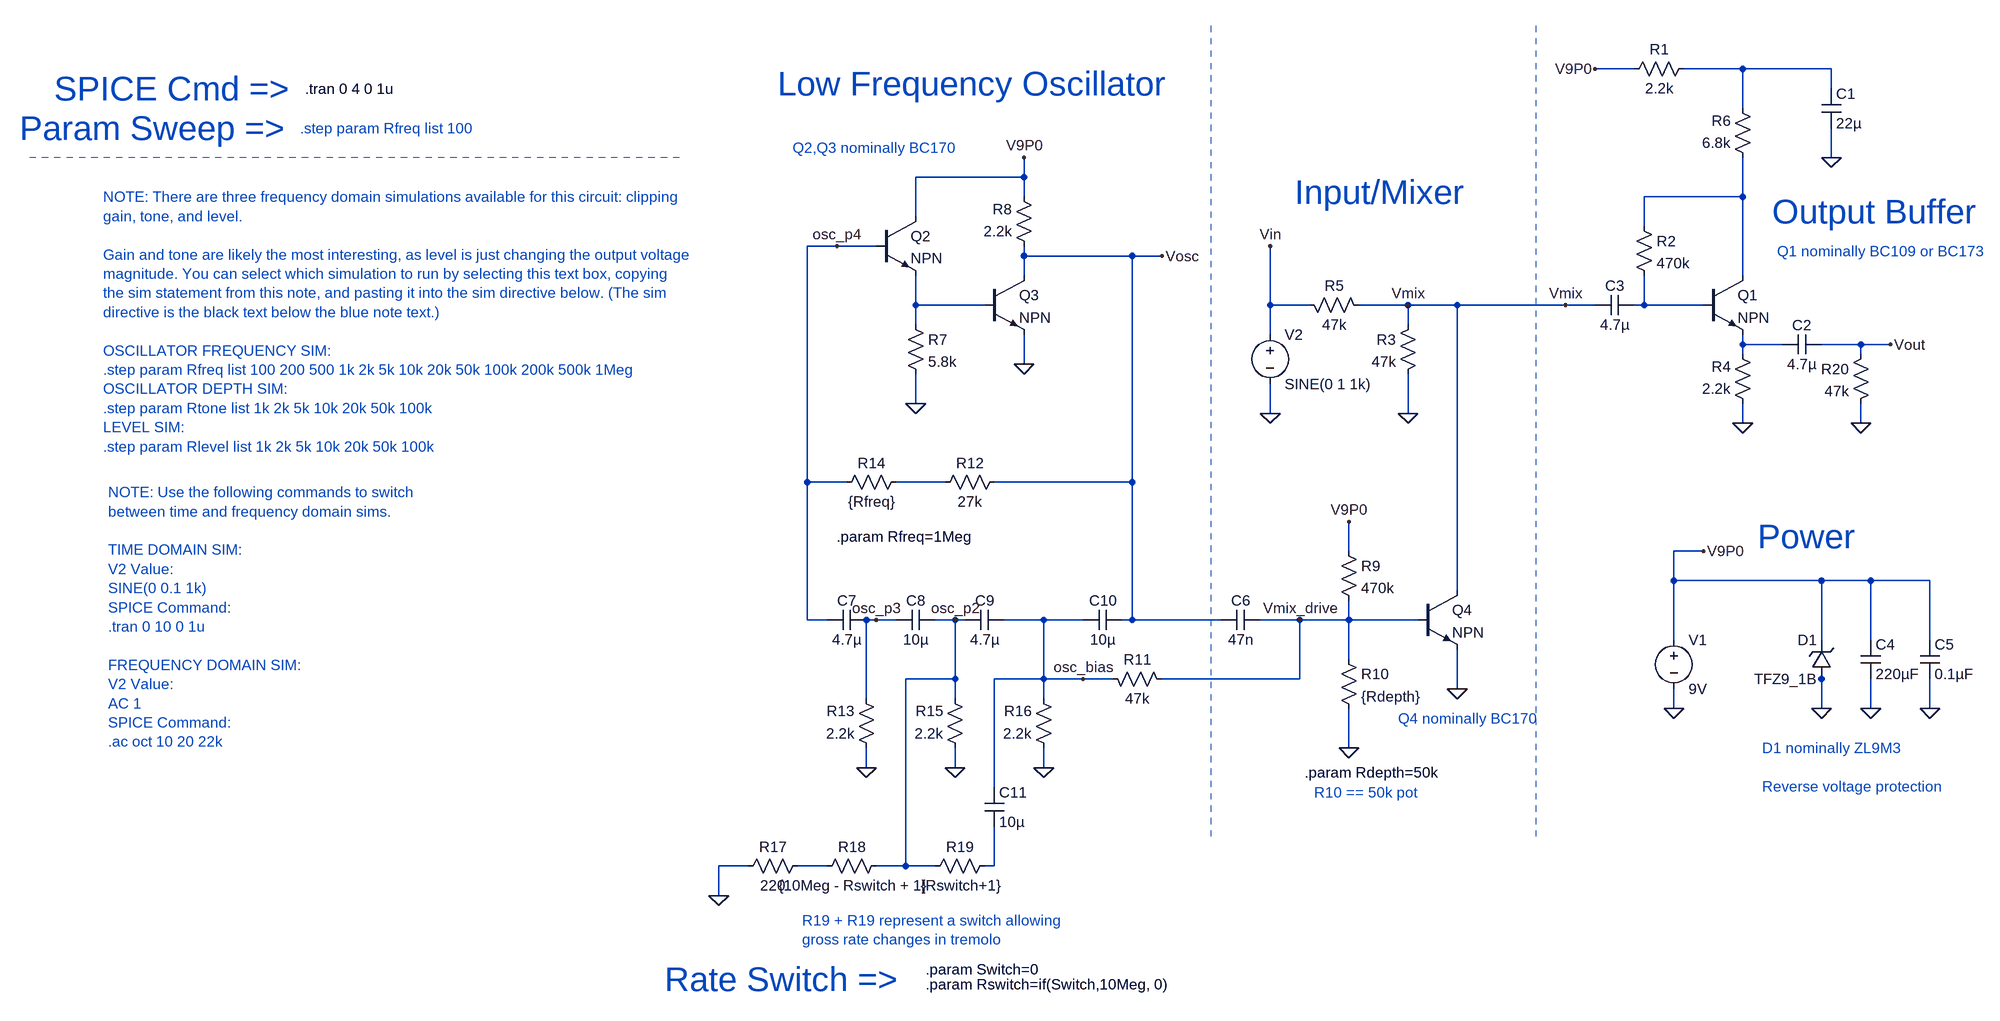
[diagram p0: schematic schaller-tremolo.asc]
schaller-tremolo.asc, the LTspice schematic file:
Version 4
SHEET 1 2340 1524
WIRE 1248 -368 1184 -368
WIRE 1424 -368 1328 -368
WIRE 1568 -368 1424 -368
WIRE 1568 -336 1568 -368
WIRE 1424 -304 1424 -368
WIRE 1568 -224 1568 -272
WIRE 256 -192 256 -224
WIRE 256 -192 80 -192
WIRE 256 -160 256 -192
WIRE 1424 -160 1424 -224
WIRE 1424 -160 1264 -160
WIRE 80 -128 80 -192
WIRE 1264 -112 1264 -160
WIRE -48 -80 -96 -80
WIRE 16 -80 -48 -80
WIRE 256 -64 256 -80
WIRE 432 -64 256 -64
WIRE 480 -64 432 -64
WIRE 256 -32 256 -64
WIRE 1424 -32 1424 -160
WIRE 80 16 80 -32
WIRE 192 16 80 16
WIRE 656 16 656 -80
WIRE 720 16 656 16
WIRE 880 16 800 16
WIRE 960 16 880 16
WIRE 1136 16 960 16
WIRE 1184 16 1136 16
WIRE 1264 16 1264 -32
WIRE 1264 16 1248 16
WIRE 1360 16 1264 16
WIRE 80 48 80 16
WIRE 880 48 880 16
WIRE 656 64 656 16
WIRE 1424 80 1424 64
WIRE 1488 80 1424 80
WIRE 1616 80 1552 80
WIRE 1664 80 1616 80
WIRE 1424 96 1424 80
WIRE 1616 96 1616 80
WIRE 256 112 256 64
WIRE 80 176 80 128
WIRE 656 192 656 144
WIRE 880 192 880 128
WIRE 1424 208 1424 176
WIRE 1616 208 1616 176
WIRE -96 304 -96 -80
WIRE -32 304 -96 304
WIRE 128 304 48 304
WIRE 432 304 432 -64
WIRE 432 304 208 304
WIRE 784 416 784 368
WIRE 1360 416 1312 416
WIRE 1312 464 1312 416
WIRE 1552 464 1312 464
WIRE 1632 464 1552 464
WIRE 1728 464 1632 464
WIRE 960 480 960 16
WIRE -96 528 -96 304
WIRE -64 528 -96 528
WIRE 0 528 -16 528
WIRE 16 528 0 528
WIRE 48 528 16 528
WIRE 144 528 112 528
WIRE 160 528 144 528
WIRE 288 528 224 528
WIRE 352 528 288 528
WIRE 432 528 432 304
WIRE 432 528 416 528
WIRE 576 528 432 528
WIRE 704 528 640 528
WIRE 784 528 784 496
WIRE 784 528 704 528
WIRE 896 528 784 528
WIRE 1312 560 1312 464
WIRE 1552 560 1552 464
WIRE 1632 560 1632 464
WIRE 1728 560 1728 464
WIRE 784 592 784 528
WIRE 144 624 144 528
WIRE 144 624 64 624
WIRE 288 624 288 528
WIRE 288 624 208 624
WIRE 352 624 288 624
WIRE 400 624 352 624
WIRE 704 624 704 528
WIRE 704 624 480 624
WIRE 1552 624 1552 608
WIRE 960 640 960 576
WIRE 0 656 0 528
WIRE 144 656 144 624
WIRE 288 656 288 624
WIRE 1312 672 1312 640
WIRE 1552 672 1552 624
WIRE 1632 672 1632 624
WIRE 1728 672 1728 624
WIRE 784 736 784 672
WIRE 0 768 0 736
WIRE 144 768 144 736
WIRE 288 768 288 736
WIRE 208 800 208 624
WIRE -192 928 -240 928
WIRE -64 928 -112 928
WIRE 64 928 64 624
WIRE 64 928 16 928
WIRE 112 928 64 928
WIRE 208 928 208 864
WIRE 208 928 192 928
WIRE -240 976 -240 928
FLAG 1312 672 0
FLAG 880 192 0
FLAG 656 192 0
FLAG 1632 672 0
FLAG 1728 672 0
FLAG 1360 416 V9P0
FLAG 1552 672 0
FLAG 656 -80 Vin
FLAG 1184 -368 V9P0
FLAG 1424 208 0
FLAG 1568 -224 0
FLAG 1664 80 Vout
FLAG 256 -224 V9P0
FLAG 80 176 0
FLAG 256 112 0
FLAG 960 640 0
FLAG 784 736 0
FLAG 784 368 V9P0
FLAG 0 768 0
FLAG 144 768 0
FLAG 288 768 0
FLAG -240 976 0
FLAG 480 -64 Vosc
FLAG 1616 208 0
FLAG 880 16 Vmix
FLAG 1136 16 Vmix
FLAG 704 528 Vmix_drive
FLAG 352 624 osc_bias
FLAG 144 528 osc_p2
FLAG 16 528 osc_p3
FLAG -48 -80 osc_p4
SYMBOL voltage 1312 544 R0
SYMATTR InstName V1
SYMATTR Value 9V
SYMBOL cap 1552 64 R90
WINDOW 0 0 32 VBottom 2
WINDOW 3 32 32 VTop 2
SYMATTR InstName C2
SYMATTR Value 4.7µ
SYMBOL res 1344 -384 R90
WINDOW 0 0 56 VBottom 2
WINDOW 3 32 56 VTop 2
SYMATTR InstName R1
SYMATTR Value 2.2k
SYMBOL cap 1248 0 R90
WINDOW 0 0 32 VBottom 2
WINDOW 3 32 32 VTop 2
SYMATTR InstName C3
SYMATTR Value 4.7µ
SYMBOL res 1248 -128 R0
SYMATTR InstName R2
SYMATTR Value 470k
SYMBOL res 896 32 M0
SYMATTR InstName R3
SYMATTR Value 47k
SYMBOL voltage 656 48 R0
WINDOW 123 24 124 Left 2
WINDOW 39 0 0 Left 0
SYMATTR InstName V2
SYMATTR Value SINE(0 1 1k)
SYMBOL cap 1616 560 R0
SYMATTR InstName C4
SYMATTR Value 220µF
SYMBOL cap 1712 560 R0
SYMATTR InstName C5
SYMATTR Value 0.1µF
SYMBOL zener 1568 624 R180
WINDOW 0 24 64 Left 2
WINDOW 3 24 0 Left 2
SYMATTR InstName D1
SYMATTR Value TFZ9_1B
SYMATTR Description Diode
SYMATTR Type diode
SYMBOL res -48 320 R270
WINDOW 0 32 56 VTop 2
WINDOW 3 0 56 VBottom 2
SYMATTR InstName R14
SYMATTR Value {Rfreq}
SYMBOL npn 1360 -32 R0
SYMATTR InstName Q1
SYMBOL res 1440 192 R180
WINDOW 0 36 76 Left 2
WINDOW 3 36 40 Left 2
SYMATTR InstName R4
SYMATTR Value 2.2k
SYMBOL res 112 320 R270
WINDOW 0 32 56 VTop 2
WINDOW 3 0 56 VBottom 2
SYMATTR InstName R12
SYMATTR Value 27k
SYMBOL cap 1552 -336 R0
SYMATTR InstName C1
SYMATTR Value 22µ
SYMBOL res 1440 -208 R180
WINDOW 0 36 76 Left 2
WINDOW 3 36 40 Left 2
SYMATTR InstName R6
SYMATTR Value 6.8k
SYMBOL res 816 32 M270
WINDOW 0 32 56 VTop 2
WINDOW 3 0 56 VBottom 2
SYMATTR InstName R5
SYMATTR Value 47k
SYMBOL npn 16 -128 R0
SYMATTR InstName Q2
SYMBOL npn 192 -32 R0
SYMATTR InstName Q3
SYMBOL res 64 32 R0
SYMATTR InstName R7
SYMATTR Value 5.8k
SYMBOL res 272 -64 R180
WINDOW 0 36 76 Left 2
WINDOW 3 36 40 Left 2
SYMATTR InstName R8
SYMATTR Value 2.2k
SYMBOL npn 896 480 R0
SYMATTR InstName Q4
SYMBOL res 768 576 R0
SYMATTR InstName R10
SYMATTR Value {Rdepth}
SYMBOL res 768 400 R0
SYMATTR InstName R9
SYMATTR Value 470k
SYMBOL cap 640 512 R90
WINDOW 0 0 32 VBottom 2
WINDOW 3 32 32 VTop 2
SYMATTR InstName C6
SYMATTR Value 47n
SYMBOL res 496 640 M270
WINDOW 0 32 56 VTop 2
WINDOW 3 0 56 VBottom 2
SYMATTR InstName R11
SYMATTR Value 47k
SYMBOL cap 0 512 R90
WINDOW 0 0 32 VBottom 2
WINDOW 3 32 32 VTop 2
SYMATTR InstName C7
SYMATTR Value 4.7µ
SYMBOL cap 112 512 R90
WINDOW 0 0 32 VBottom 2
WINDOW 3 32 32 VTop 2
SYMATTR InstName C8
SYMATTR Value 10µ
SYMBOL cap 224 512 R90
WINDOW 0 0 32 VBottom 2
WINDOW 3 32 32 VTop 2
SYMATTR InstName C9
SYMATTR Value 4.7µ
SYMBOL cap 416 512 R90
WINDOW 0 0 32 VBottom 2
WINDOW 3 32 32 VTop 2
SYMATTR InstName C10
SYMATTR Value 10µ
SYMBOL res 16 752 R180
WINDOW 0 36 76 Left 2
WINDOW 3 36 40 Left 2
SYMATTR InstName R13
SYMATTR Value 2.2k
SYMBOL res 160 752 R180
WINDOW 0 36 76 Left 2
WINDOW 3 36 40 Left 2
SYMATTR InstName R15
SYMATTR Value 2.2k
SYMBOL res 304 752 R180
WINDOW 0 36 76 Left 2
WINDOW 3 36 40 Left 2
SYMATTR InstName R16
SYMATTR Value 2.2k
SYMBOL cap 192 800 R0
SYMATTR InstName C11
SYMATTR Value 10µ
SYMBOL res -96 912 R90
WINDOW 0 0 56 VBottom 2
WINDOW 3 32 56 VTop 2
SYMATTR InstName R17
SYMATTR Value 220
SYMBOL res -80 944 R270
WINDOW 0 32 56 VTop 2
WINDOW 3 0 56 VBottom 2
SYMATTR InstName R18
SYMATTR Value {10Meg - Rswitch + 1}
SYMBOL res 96 944 R270
WINDOW 0 32 56 VTop 2
WINDOW 3 0 56 VBottom 2
SYMATTR InstName R19
SYMATTR Value {Rswitch+1}
SYMBOL res 1632 80 M0
SYMATTR InstName R20
SYMATTR Value 47k
TEXT 696 -168 Left 5 ;Input/Mixer
TEXT -144 -344 Left 5 ;Low Frequency Oscillator
TEXT 1448 392 Left 5 ;Power
TEXT 1456 736 Left 2 ;D1 nominally ZL9M3\n \nReverse voltage protection
TEXT -1240 -160 Left 2 ;NOTE: There are three frequency domain simulations available for this circuit: clipping \ngain, tone, and level.\n \nGain and tone are likely the most interesting, as level is just changing the output voltage \nmagnitude. You can select which simulation to run by selecting this text box, copying \nthe sim statement from this note, and pasting it into the sim directive below. (The sim \ndirective is the black text below the blue note text.)\n \nOSCILLATOR FREQUENCY SIM:\n.step param Rfreq list 100 200 500 1k 2k 5k 10k 20k 50k 100k 200k 500k 1Meg\nOSCILLATOR DEPTH SIM:\n.step param Rtone list 1k 2k 5k 10k 20k 50k 100k\nLEVEL SIM:\n.step param Rlevel list 1k 2k 5k 10k 20k 50k 100k
TEXT -920 -272 Left 2 ;.step param Rfreq list 100
TEXT -912 -336 Left 2 !.tran 0 4 0 1u
TEXT -1320 -336 Left 5 ;SPICE Cmd =>
TEXT -1376 -272 Left 5 ;Param Sweep =>
TEXT -1232 320 Left 2 ;NOTE: Use the following commands to switch \nbetween time and frequency domain sims.\n \nTIME DOMAIN SIM:\nV2 Value: \nSINE(0 0.1 1k)\nSPICE Command: \n.tran 0 10 0 1u\n \nFREQUENCY DOMAIN SIM:\nV2 Value: \nAC 1\nSPICE Command:\n.ac oct 10 20 22k
TEXT 1480 -72 Left 2 ;Q1 nominally BC109 or BC173
TEXT 96 1096 Left 2 !.param Switch=0
TEXT -328 1112 Left 5 ;Rate Switch =>
TEXT 96 1120 Left 2 !.param Rswitch=if(Switch,10Meg, 0)
TEXT -48 392 Left 2 !.param Rfreq=1Meg
TEXT 712 776 Left 2 !.param Rdepth=50k
TEXT -120 -240 Left 2 ;Q2,Q3 nominally BC170
TEXT 864 688 Left 2 ;Q4 nominally BC170
TEXT 1472 -136 Left 5 ;Output Buffer
TEXT -104 1016 Left 2 ;R19 + R19 represent a switch allowing \ngross rate changes in tremolo
TEXT 728 808 Left 2 ;R10 == 50k pot
LINE Normal 560 880 560 -448 2
LINE Normal -304 -224 -1360 -224 2
LINE Normal 1088 880 1088 -448 2

The netlist it stands for:
* schaller-tremolo.asc
V1 V9P0 0 9V
C2 Vout N005 4.7µ
R1 N001 V9P0 2.2k
C3 N004 Vmix 4.7µ
R2 N002 N004 470k
R3 Vmix 0 47k
V2 Vin 0 SINE(0 1 1k)
C4 V9P0 0 220µF
C5 V9P0 0 0.1µF
D1 0 V9P0 TFZ9_1B
R14 osc_p4 N006 {Rfreq}
Q1 N002 N004 N005 0 NPN
R4 0 N005 2.2k
R12 N006 Vosc 27k
C1 N001 0 22µ
R6 N002 N001 6.8k
R5 Vmix Vin 47k
Q2 V9P0 osc_p4 N003 0 NPN
Q3 Vosc N003 0 0 NPN
R7 N003 0 5.8k
R8 Vosc V9P0 2.2k
Q4 Vmix Vmix_drive 0 0 NPN
R10 Vmix_drive 0 {Rdepth}
R9 V9P0 Vmix_drive 470k
C6 Vmix_drive Vosc 47n
R11 Vmix_drive osc_bias 47k
C7 osc_p3 osc_p4 4.7µ
C8 osc_p2 osc_p3 10µ
C9 osc_bias osc_p2 4.7µ
C10 Vosc osc_bias 10µ
R13 0 osc_p3 2.2k
R15 0 osc_p2 2.2k
R16 0 osc_bias 2.2k
C11 osc_bias N008 10µ
R17 N007 0 220
R18 N007 osc_p2 {10Meg - Rswitch + 1}
R19 osc_p2 N008 {Rswitch+1}
R20 Vout 0 47k
.model D D
.lib standard.dio
.model NPN NPN
.model PNP PNP
.lib standard.bjt
* Input/Mixer
* Low Frequency Oscillator
* Power
* D1 nominally ZL9M3
* Reverse voltage protection
* NOTE: There are three frequency domain simulations available for this circuit: clipping
* gain, tone, and level.
* Gain and tone are likely the most interesting, as level is just changing the output voltage
* magnitude. You can select which simulation to run by selecting this text box, copying
* the sim statement from this note, and pasting it into the sim directive below. (The sim
* directive is the black text below the blue note text.)
* OSCILLATOR FREQUENCY SIM:
* .step param Rfreq list 100 200 500 1k 2k 5k 10k 20k 50k 100k 200k 500k 1Meg
* OSCILLATOR DEPTH SIM:
* .step param Rtone list 1k 2k 5k 10k 20k 50k 100k
* LEVEL SIM:
* .step param Rlevel list 1k 2k 5k 10k 20k 50k 100k
* .step param Rfreq list 100
.tran 0 4 0 1u
* SPICE Cmd =>
* Param Sweep =>
* NOTE: Use the following commands to switch
* between time and frequency domain sims.
* TIME DOMAIN SIM:
* V2 Value:
* SINE(0 0.1 1k)
* SPICE Command:
* .tran 0 10 0 1u
* FREQUENCY DOMAIN SIM:
* V2 Value:
* AC 1
* SPICE Command:
* .ac oct 10 20 22k
* Q1 nominally BC109 or BC173
.param Switch=0
* Rate Switch =>
.param Rswitch=if(Switch,10Meg, 0)
.param Rfreq=1Meg
.param Rdepth=50k
* Q2,Q3 nominally BC170
* Q4 nominally BC170
* Output Buffer
* R19 + R19 represent a switch allowing
* gross rate changes in tremolo
* R10 == 50k pot
.backanno
.end